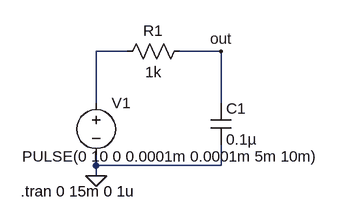
[diagram p0: schematic TRAN.asc]
TRAN.asc, the LTspice schematic file:
Version 4
SHEET 1 880 680
WIRE 128 64 80 64
WIRE 272 64 208 64
WIRE 80 144 80 64
WIRE 272 144 272 64
WIRE 80 240 80 224
WIRE 272 240 272 208
WIRE 272 240 80 240
WIRE 80 256 80 240
FLAG 272 64 out
FLAG 80 256 0
SYMBOL voltage 80 128 R0
WINDOW 3 -114 98 Left 2
WINDOW 123 0 0 Left 0
WINDOW 39 0 0 Left 0
SYMATTR InstName V1
SYMATTR Value PULSE(0 10 0 0.0001m 0.0001m 5m 10m)
SYMBOL res 224 48 R90
WINDOW 0 0 56 VBottom 2
WINDOW 3 32 56 VTop 2
SYMATTR InstName R1
SYMATTR Value 1k
SYMBOL cap 256 144 R0
SYMATTR InstName C1
SYMATTR Value 0.1µ
TEXT -36 280 Left 2 !.tran 0 15m 0 1u

The netlist it stands for:
* TRAN.asc
V1 N001 0 PULSE(0 10 0 0.0001m 0.0001m 5m 10m)
R1 out N001 1k
C1 out 0 0.1µ
.tran 0 15m 0 1u
.backanno
.end